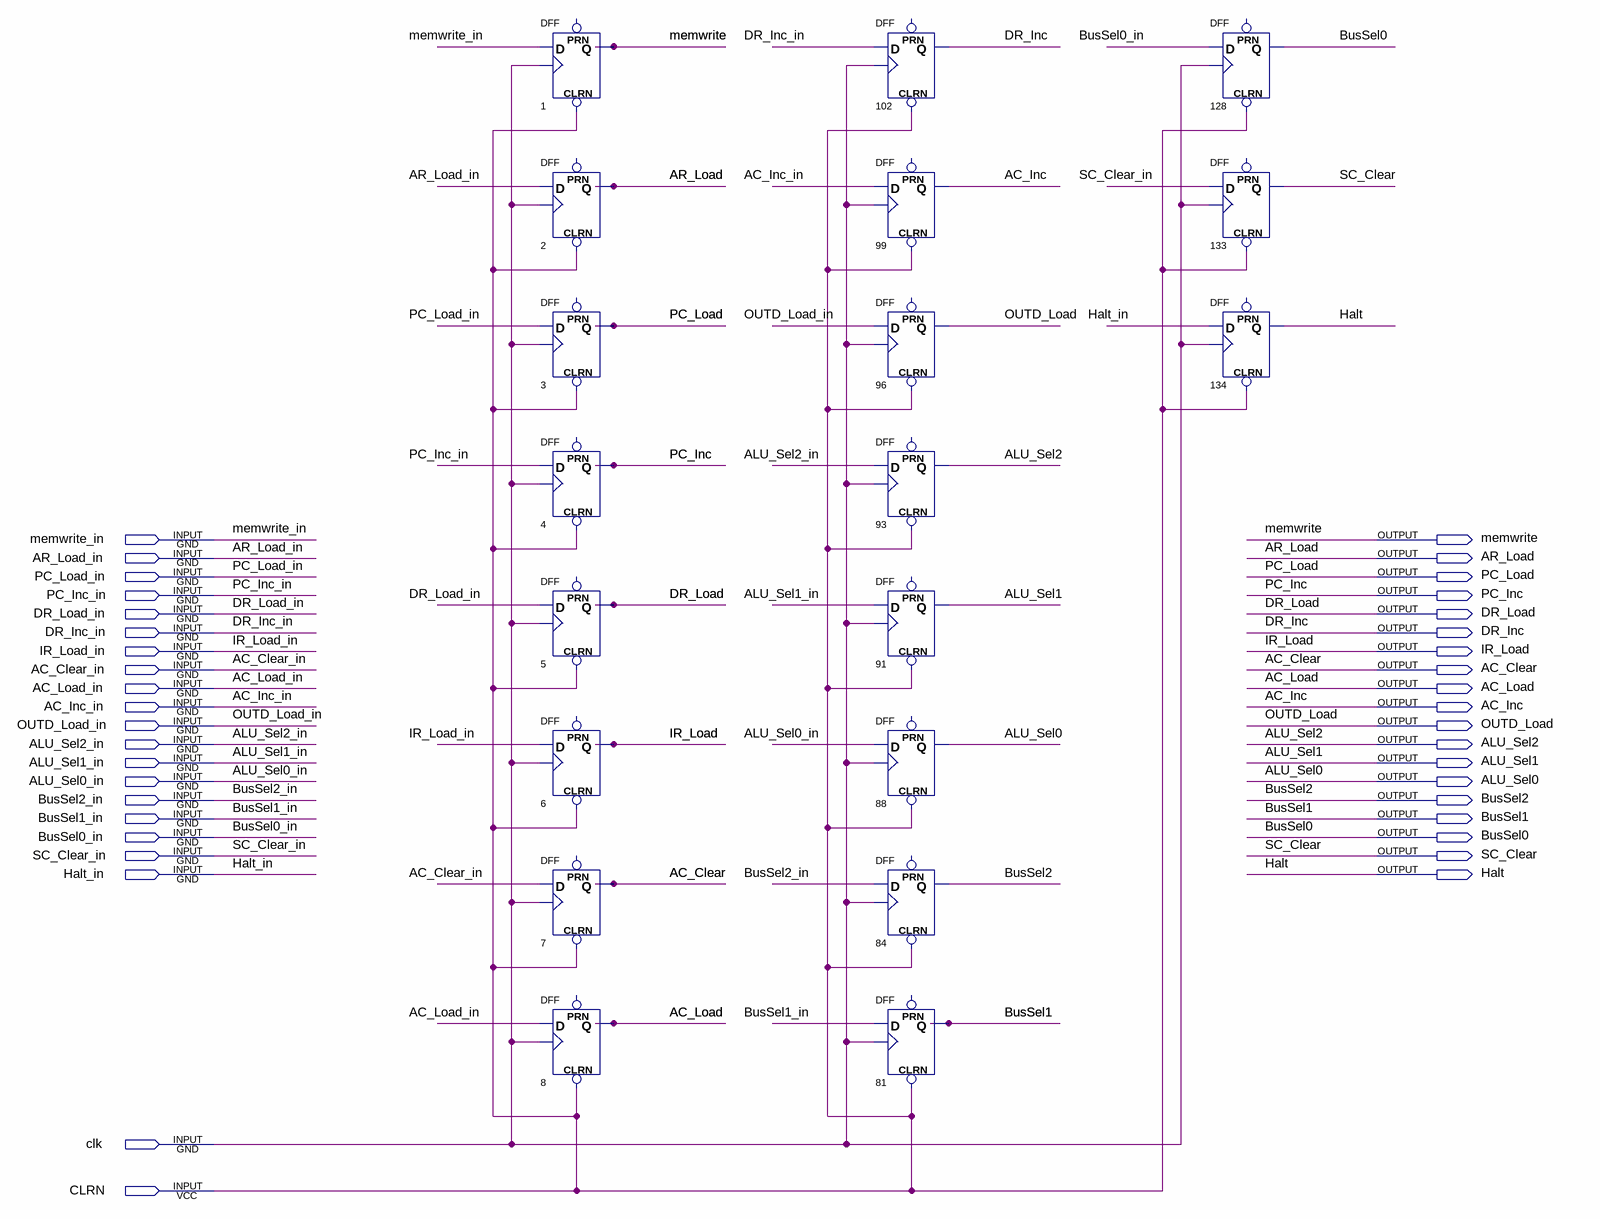
[diagram p0: schematic sheet]
// Quartus schematic controlregister.bdf as structural Verilog: 19 symbols, 40 pins
module controlregister (
  input  memwrite_in,
  input  AR_Load_in,
  input  PC_Load_in,
  input  PC_Inc_in,
  input  DR_Load_in,
  input  DR_Inc_in,
  input  IR_Load_in,
  input  AC_Clear_in,
  input  AC_Load_in,
  input  AC_Inc_in,
  input  OUTD_Load_in,
  input  ALU_Sel2_in,
  input  ALU_Sel1_in,
  input  ALU_Sel0_in,
  input  BusSel2_in,
  input  BusSel1_in,
  input  BusSel0_in,
  input  SC_Clear_in,
  input  Halt_in,
  input  clk,
  input  CLRN,
  output memwrite,
  output AR_Load,
  output PC_Load,
  output PC_Inc,
  output DR_Load,
  output DR_Inc,
  output IR_Load,
  output AC_Clear,
  output AC_Load,
  output AC_Inc,
  output OUTD_Load,
  output ALU_Sel2,
  output ALU_Sel1,
  output ALU_Sel0,
  output BusSel2,
  output BusSel1,
  output BusSel0,
  output SC_Clear,
  output Halt
);

  DFF u_1 (.CLRN(CLRN), .CLK(clk), .D(memwrite_in), .Q(memwrite));  // open: PRN
  DFF u_2 (.CLRN(CLRN), .CLK(clk), .D(AR_Load_in), .Q(AR_Load));  // open: PRN
  DFF u_3 (.CLRN(CLRN), .CLK(clk), .D(PC_Load_in), .Q(PC_Load));  // open: PRN
  DFF u_4 (.CLRN(CLRN), .CLK(clk), .D(PC_Inc_in), .Q(PC_Inc));  // open: PRN
  DFF u_5 (.CLRN(CLRN), .CLK(clk), .D(DR_Load_in), .Q(DR_Load));  // open: PRN
  DFF u_6 (.CLRN(CLRN), .CLK(clk), .D(IR_Load_in), .Q(IR_Load));  // open: PRN
  DFF u_7 (.CLRN(CLRN), .CLK(clk), .D(AC_Clear_in), .Q(AC_Clear));  // open: PRN
  DFF u_8 (.CLRN(CLRN), .CLK(clk), .D(AC_Load_in), .Q(AC_Load));  // open: PRN
  DFF u_102 (.CLRN(CLRN), .CLK(clk), .D(DR_Inc_in), .Q(DR_Inc));  // open: PRN
  DFF u_99 (.CLRN(CLRN), .CLK(clk), .D(AC_Inc_in), .Q(AC_Inc));  // open: PRN
  DFF u_96 (.CLRN(CLRN), .CLK(clk), .D(OUTD_Load_in), .Q(OUTD_Load));  // open: PRN
  DFF u_93 (.CLRN(CLRN), .CLK(clk), .D(ALU_Sel2_in), .Q(ALU_Sel2));  // open: PRN
  DFF u_91 (.CLRN(CLRN), .CLK(clk), .D(ALU_Sel1_in), .Q(ALU_Sel1));  // open: PRN
  DFF u_88 (.CLRN(CLRN), .CLK(clk), .D(ALU_Sel0_in), .Q(ALU_Sel0));  // open: PRN
  DFF u_84 (.CLRN(CLRN), .CLK(clk), .D(BusSel2_in), .Q(BusSel2));  // open: PRN
  DFF u_81 (.CLRN(CLRN), .CLK(clk), .D(BusSel1_in), .Q(BusSel1));  // open: PRN
  DFF u_128 (.CLRN(CLRN), .CLK(clk), .D(BusSel0_in), .Q(BusSel0));  // open: PRN
  DFF u_133 (.CLRN(CLRN), .CLK(clk), .D(SC_Clear_in), .Q(SC_Clear));  // open: PRN
  DFF u_134 (.CLRN(CLRN), .CLK(clk), .D(Halt_in), .Q(Halt));  // open: PRN
endmodule
